# Altium schematic sheet FuzzerFuca.SchDoc: FuzzerFuça
size A4; Revision: 1.0; SheetNumber: 1
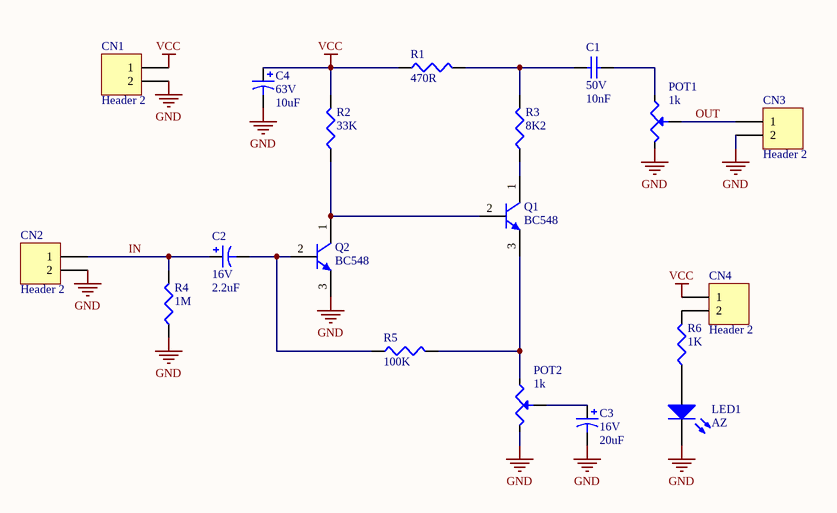
[diagram p0: FuzzerFuca.SchDoc]

## Parts
C1  value 10nF  Tensão: 50V  [CCERAMIC-02I]  (hidden comment: Capacitor Cerâmico)
C2  value 2.2uF  Tensão: 16V  [CPOLRAD5X11]  (hidden comment: Capacitor Tântalo)
C3  value 20uF  Tensão: 16V  [CPOLRAD5X11]  (hidden comment: Capacitor Tântalo)
C4  value 10uF  Tensão: 63V  [CPOLRAD5X11]  (hidden comment: Capacitor Eletrolítico)
CN1  Header 2  [CONN HDR1X2]
CN2  Header 2  [CONN HDR1X2]
CN3  Header 2  [CONN HDR1X2]
CN4  Header 2  [CONN HDR1X2]
LED1  value AZ  [LED 5MM]  (hidden comment: LED TH 5MM AZ)
POT1  value 1k  [POT - GENERICO]  (hidden comment: Potenciômetro)
POT2  value 1k  [POT - GENERICO]  (hidden comment: Potenciômetro)
Q1  BC548  [TO-92]
Q2  BC548  [TO-92]
R1  value 470R  [Axial 0.125W/H]  (hidden comment: Resistor)
R2  value 33K  [Axial 0.125W/H]  (hidden comment: Resistor)
R3  value 8K2  [Axial 0.125W/H]  (hidden comment: Resistor)
R4  value 1M  [Axial 0.125W/H]  (hidden comment: Resistor)
R5  value 100K  [Axial 0.125W/H]  (hidden comment: Resistor)
R6  value 1K  [Axial 0.125W/H]  (hidden comment: Resistor)

## Nets
GND: C3.2 C4.2 CN1.2 CN2.2 CN3.2 LED1.2(K) POT1.3 POT2.3 Q2.3(E) R4.1
VCC: C4.1 CN1.1 CN4.1 R1.1 R2.2
IN: C2.1 CN2.1 R4.2
OUT: CN3.1 POT1.2(TAP)
NetC1_1: C1.1 R1.2 R3.2
NetC1_2: C1.2 POT1.1
NetC2_2: C2.2 Q2.2(B) R5.1
NetC3_1: C3.1 POT2.2(TAP)
NetCN4_2: CN4.2 R6.2
NetLED1_1: LED1.1(A) R6.1
NetPOT2_1: POT2.1 Q1.3(E) R5.2
NetQ1_1: Q1.1(C) R3.1
NetQ1_2: Q1.2(B) Q2.1(C) R2.1

## Notes on the sheet
- Projeto:
- Tamanho:
- Data:
- A4
- Eng. Felipe Navarro
- Hora:
- Revisão:
- Folha
- de
- Arquivo:

## Library data of the parts
C1 = Cap 10nF 50V 0603 X7R 5%: Capacitor (Semiconductor SIM Model); Chinês: Local; ChinesePrice: 0,00320; Corrente: *A; Potência: *W; Obs:: X7R; Tolerância: ±5%; Supplier 1: Digi-Key; Supplier Part Number 1: 399-1092-1-ND; ComponentLink1Description: Datasheet; ComponentLink1URL: D:\Tecnoclade\Datasheet\!DataMissing.pdf
C2 C3 = PCap 2.2uF 16V 1206 LOESR: Polarized Capacitor; ChinesePrice: 0,00000; Chinês: ----; Corrente: *A; Potência: *W; Obs: LOESR (6R); Tolerância: ±10%; Supplier 1: Digi-Key; Supplier Part Number 1: 399-3691-1-ND; ComponentLink1Description: Datasheet; ComponentLink1URL: D:\Tecnoclade\Datasheet\!DataMissing.pdf
C4 = PCap 10uF 63V 5d.x13h: Polarized Capacitor (Radial); ChinesePrice: 0,00000; Chinês: ----; Corrente: *A; Potência: *W; Obs: UPM1J100MDD1TD - Alumínio; Tolerância: ±20%; Supplier 1: Digi-Key; Supplier Part Number 1: 493-7402-1-ND; ComponentLink1Description: Datasheet; ComponentLink1URL: D:\Tecnoclade\Datasheet\!DataMissing.pdf
CN1-CN4 = Header 2: Header, 2-Pin; ChinesePrice: 0,10000; Chinês: Proved - Local; Value: Barra de 40 pinos - ATENÇÃO; Corrente: *; Potência: *; Supplier 1: Digi-Key; Supplier Part Number 1: A26509-40-ND; Tensão: *; Obs:: *; Tolerância: *; ComponentLink1Description: Datasheet; ComponentLink1URL: D:\Tecnoclade\Datasheet\!DataMissing.pdf
LED1 = LED TH 5MM AZ: LED; ChinesePrice: 0,00000; Chinês: ----; Tolerância: 2V7; Corrente: *; Potência: *; Supplier 1: Digi-Key; Supplier Part Number 1: 732-5019-ND; Tensão: *; Obs:: *; ComponentLink1Description: Datasheet; ComponentLink1URL: D:\Tecnoclade\Datasheet\!DataMissing.pdf
POT1 POT2 = POT 100k Audio: Potenciometro; ChinesePrice: 0,00000; Chinês: ----; Corrente: *A; Potência: *W; Tensão: *V; Tolerância: ±*%; Supplier 1: Digi-Key; Supplier Part Number 1: PTV09A-2020F-B104-ND; Obs: *; ComponentLink1Description: Datasheet; ComponentLink1URL: D:\Tecnoclade\Datasheet\!DataMissing.pdf
Q1 Q2 = TRS BC548 30V 100mA TO-92: NPN General Purpose Amplifier; Tensão: 30V; Corrente: 100mA; Chinês: ----; ChinesePrice: 0,00000; Value: 300MHz; Potência: *; Supplier 1: Digi-Key; Supplier Part Number 1: BC548CTAFSCT-ND; Obs:: *; Tolerância: *; ComponentLink1URL: D:\Tecnoclade\DatasheetBC548x.pdf; ComponentLink1Description: Datasheet
R1 = Res 470R 5% 0603 1/10W: ChinesePrice: 0,00000; Chinês: ----; Corrente: *A; Potência: 1/10W; Tensão: *V; Obs: ±200ppm/ºC; Tolerância: ±5%; Supplier 1: Digi-Key; Supplier Part Number 1: RMCF0603JT470RCT-ND; ComponentLink1Description: Datasheet; ComponentLink1URL: D:\Tecnoclade\Datasheet\!DataMissing.pdf
R2 = Res 33K 1% 0603 1/10W: ChinesePrice: 0,00000; Chinês: ----; Corrente: *A; Potência: 1/10W; Tensão: *V; Obs: ±100ppm/ºC; Tolerância: ±1%; Supplier 1: Digi-Key; Supplier Part Number 1: RMCF0603FT33K0CT-ND; ComponentLink1Description: Datasheet; ComponentLink1URL: D:\Tecnoclade\Datasheet\!DataMissing.pdf
R3 R6 = Res 18K2 1% 0603 1/8W: ChinesePrice: 0,00000; Chinês: ----; Corrente: *A; Potência: 1/8W; Tensão: *V; Obs: ±100ppm/ºC; Tolerância: ±1%; Supplier 1: Digi-Key; ComponentLink1Description: Datasheet; ComponentLink1URL: D:\Tecnoclade\Datasheet\!DataMissing.pdf
R4 = Res 1M 1% 0603 1/10W: ChinesePrice: 0,00089; Chinês: Local; Corrente: *A; Potência: 1/10W; Tensão: *V; Obs: ±100ppm/ºC; Tolerância: ±1%; Supplier 1: Digi-Key; Supplier Part Number 1: RMCF0603FT1M00CT-ND; ComponentLink1Description: Datasheet; ComponentLink1URL: D:\Tecnoclade\Datasheet\!DataMissing.pdf
R5 = Res 100K 1% 0603 1/10W: ChinesePrice: 0,00089; Chinês: Local; Corrente: *A; Potência: 1/10W; Tensão: *V; Tolerância: ±1%; Supplier 1: Digi-Key; Supplier Part Number 1: P100KHCT-ND; Obs: *; ComponentLink1Description: Datasheet; ComponentLink1URL: D:\Tecnoclade\Datasheet\!DataMissing.pdf